# EAGLE design maplemini-r1 (EAGLE 5.01)
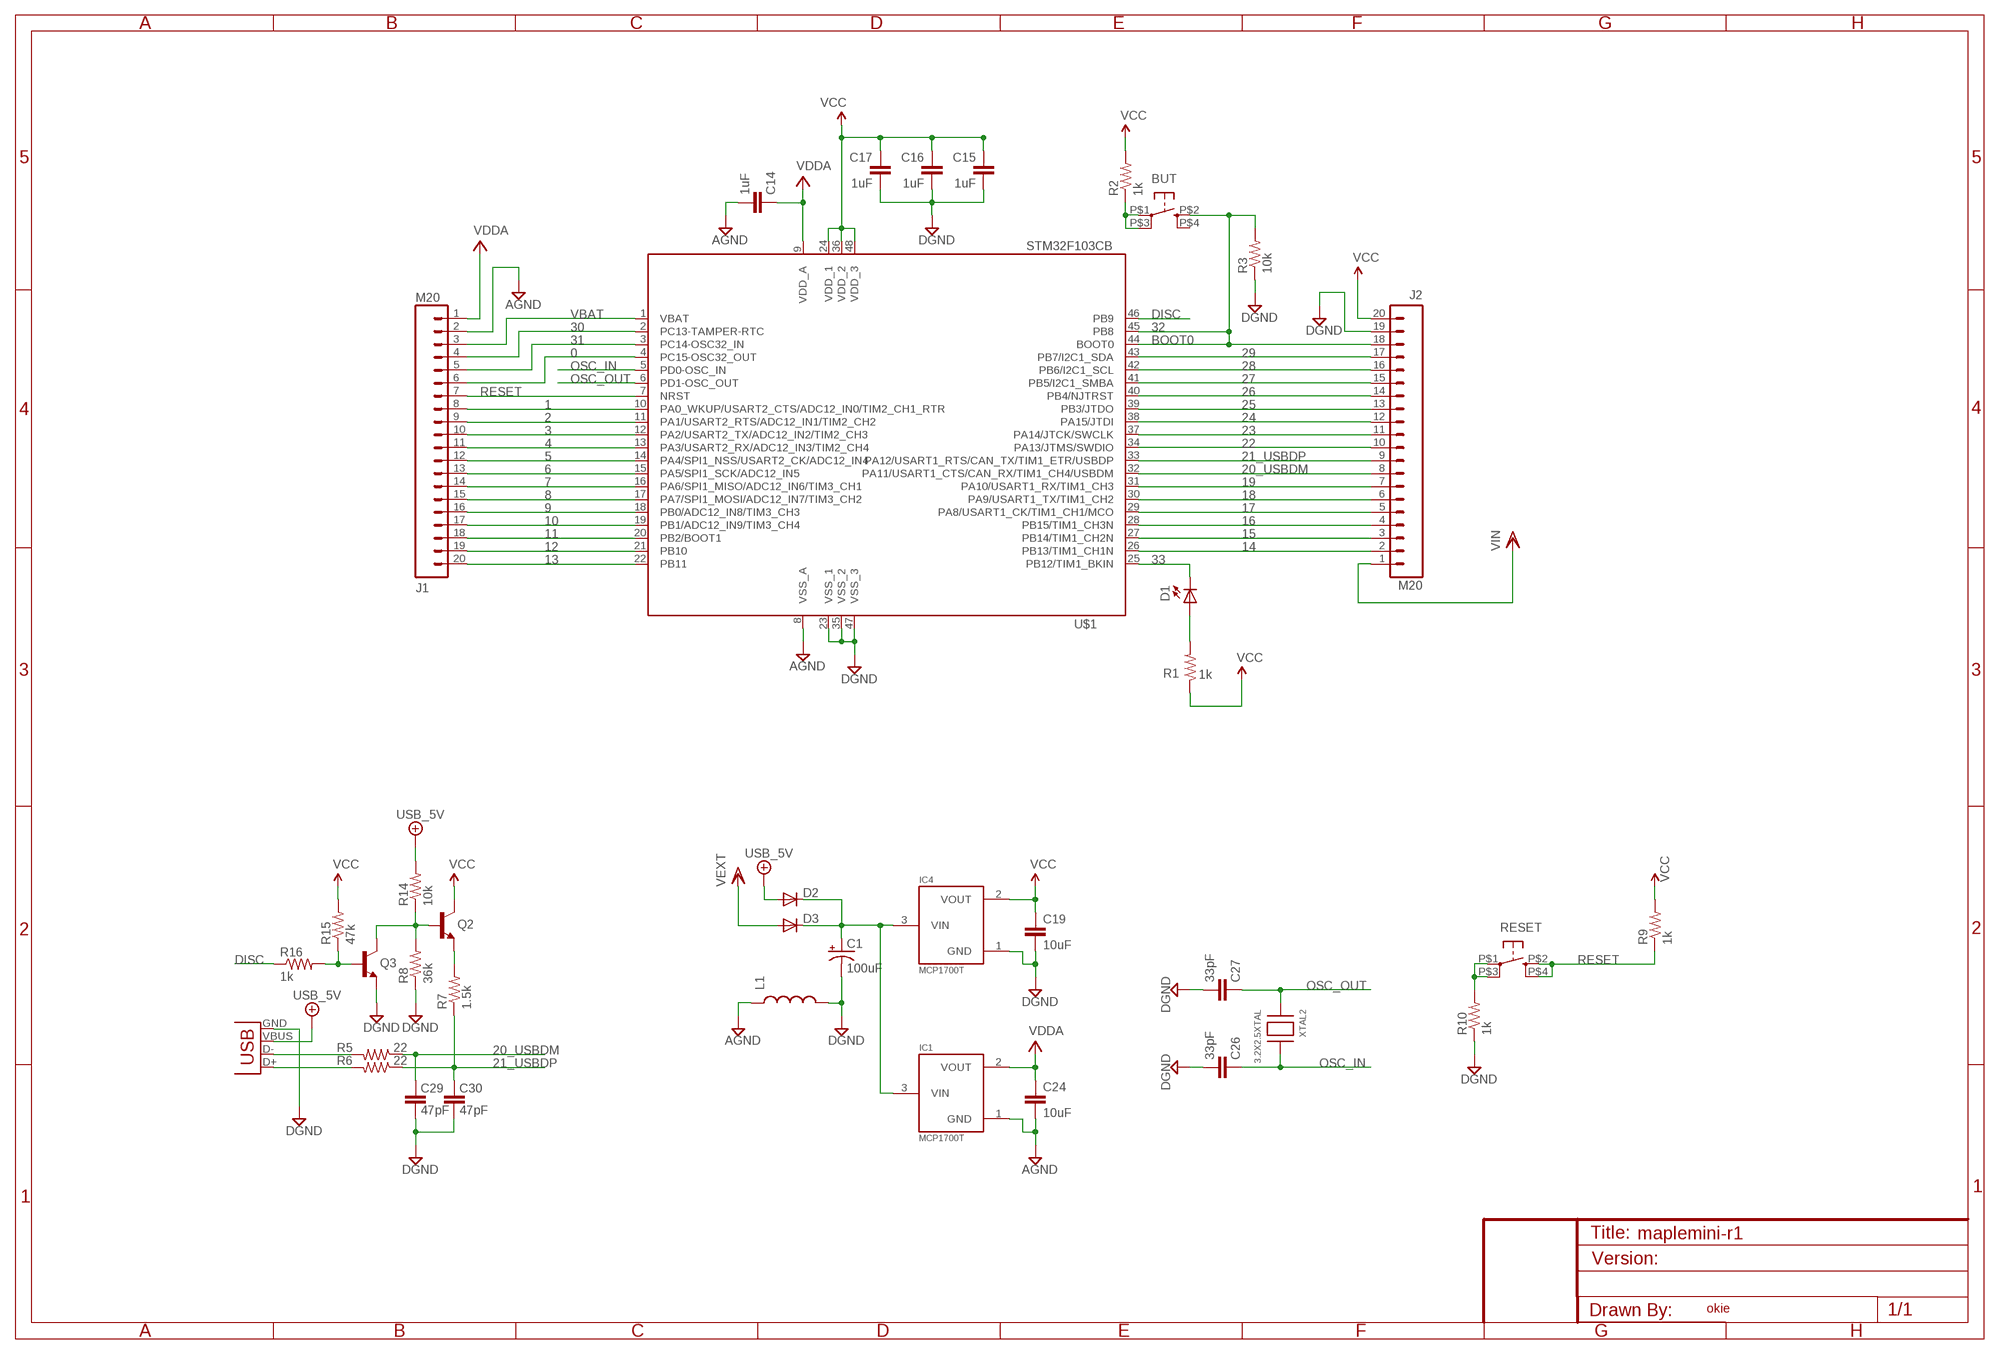
[diagram p0: schematic, sheet 1]

## Parts
BUT  BUTTON-KMR241GLFS  [PUSHBUTTON-KMR241GLFS]
C1  100uF  CAP_POL1206  [EIA3216]
C14  1uF  CAP0402  [C0402]
C15  1uF  CAP0402  [C0402]
C16  1uF  CAP0402  [C0402]
C17  1uF  CAP0402  [C0402]
C19  10uF  CAP0805  [0805]
C24  10uF  CAP0805  [0805]
C26  33pF  CAP0402  [C0402]
C27  33pF  CAP0402  [C0402]
C29  47pF  CAP0402  [C0402]
C30  47pF  CAP0402  [C0402]
D1  Green  LED0603  [LED-0603]
D2  DIODESOD  [SOD-323]
D3  DIODESOD  [SOD-323]
IC1  MCP1700T  [SOT23]
IC4  MCP1700T  [SOT23]
J1  M20  [1X20]
J2  M20  [1X20]
L1  INDUCTOR0603  [0603]
Q2  TRANSISTOR_NPNSOT23  [SOT23]
Q3  TRANSISTOR_NPNSOT23  [SOT23]
R1  1k  RESISTOR0402  [C0402]
R2  1k  RESISTOR0402  [C0402]
R3  10k  RESISTOR0402  [C0402]
R5  22  RESISTOR0402  [C0402]
R6  22  RESISTOR0402  [C0402]
R7  1.5k  RESISTOR0402  [C0402]
R8  36k  RESISTOR0402  [C0402]
R9  1k  RESISTOR0402  [C0402]
R10  1k  RESISTOR0402  [C0402]
R14  10k  RESISTOR0402  [C0402]
R15  47k  RESISTOR0402  [C0402]
R16  1k  RESISTOR0402  [C0402]
RESET  BUTTON-KMR241GLFS  [PUSHBUTTON-KMR241GLFS]
U$1  STM32F103CB  [LQFP48]
X2  USBSMD  [USB-MINIB]
XTAL2  3.2X2.5XTAL  [3.2X2.5XTAL]

## Nets
0: J1.6 U$1.4(PC15-OSC32_OUT)
1: J1.8 U$1.10(PA0_WKUP/USART2_CTS/ADC12_IN0/TIM2_CH1_RTR)
2: J1.9 U$1.11(PA1/USART2_RTS/ADC12_IN1/TIM2_CH2)
3: J1.10 U$1.12(PA2/USART2_TX/ADC12_IN2/TIM2_CH3)
4: J1.11 U$1.13(PA3/USART2_RX/ADC12_IN3/TIM2_CH4)
5: J1.12 U$1.14(PA4/SPI1_NSS/USART2_CK/ADC12_IN4)
6: J1.13 U$1.15(PA5/SPI1_SCK/ADC12_IN5)
7: J1.14 U$1.16(PA6/SPI1_MISO/ADC12_IN6/TIM3_CH1)
8: J1.15 U$1.17(PA7/SPI1_MOSI/ADC12_IN7/TIM3_CH2)
9: J1.16 U$1.18(PB0/ADC12_IN8/TIM3_CH3)
10: J1.17 U$1.19(PB1/ADC12_IN9/TIM3_CH4)
11: J1.18 U$1.20(PB2/BOOT1)
12: J1.19 U$1.21(PB10)
13: J1.20 U$1.22(PB11)
14: J2.2 U$1.26(PB13/TIM1_CH1N)
15: J2.3 U$1.27(PB14/TIM1_CH2N)
16: J2.4 U$1.28(PB15/TIM1_CH3N)
17: J2.5 U$1.29(PA8/USART1_CK/TIM1_CH1/MCO)
18: J2.6 U$1.30(PA9/USART1_TX/TIM1_CH2)
19: J2.7 U$1.31(PA10/USART1_RX/TIM1_CH3)
20_USBDM: C29.2 J2.8 R5.1 U$1.32(PA11/USART1_CTS/CAN_RX/TIM1_CH4/USBDM)
21_USBDP: C30.2 J2.9 R6.1 R7.1 U$1.33(PA12/USART1_RTS/CAN_TX/TIM1_ETR/USBDP)
22: J2.10 U$1.34(PA13/JTMS/SWDIO)
23: J2.11 U$1.37(PA14/JTCK/SWCLK)
24: J2.12 U$1.38(PA15/JTDI)
25: J2.13 U$1.39(PB3/JTDO)
26: J2.14 U$1.40(PB4/NJTRST)
27: J2.15 U$1.41(PB5/I2C1_SMBA)
28: J2.16 U$1.42(PB6/I2C1_SCL)
29: J2.17 U$1.43(PB7/I2C1_SDA)
30: J1.4 U$1.2(PC13-TAMPER-RTC)
31: J1.5 U$1.3(PC14-OSC32_IN)
33: D1.C U$1.25(PB12/TIM1_BKIN)
+5V/2: D2.2(A) R14.2 X2.VBUS ; supply symbol labelled USB_5V
AGND: C14.2 C24.2 IC1.1(GND) J1.2 L1.1 U$1.8(VSS_A)
BOOT0: BUT.P$2 J2.18 R3.2 U$1.44(BOOT0) U$1.45(PB8)
DGND: C1.C(-) C15.2 C16.2 C17.2 C19.2 C26.2 C27.2 C29.1 C30.1 IC4.1(GND) J2.19 L1.2 Q3.2(E) R3.1 R8.1 R10.1 U$1.23(VSS_1) U$1.35(VSS_2) U$1.47(VSS_3) X2.GND
DISC: R16.1 U$1.46(PB9)
N$1: BUT.P$1 BUT.P$3 R2.1
N$4: R10.2 RESET.P$1 RESET.P$3
N$5: C1.A(+) D2.1(C) D3.1(C) IC1.3(VIN) IC4.3(VIN)
N$51: Q2.2(E) R7.2
N$59: R5.2 X2.D-
N$60: R6.2 X2.D+
N$69: D1.A R1.2
N$71: Q2.1(B) Q3.3(C) R8.2 R14.1
N$73: Q3.1(B) R15.1 R16.2
OSC_IN: C26.1 U$1.5(PD0-OSC_IN) XTAL2.P$3
OSC_OUT: C27.1 U$1.6(PD1-OSC_OUT) XTAL2.P$1
RESET: J1.7 R9.1 RESET.P$2 RESET.P$4 U$1.7(NRST)
VBAT: J1.3 U$1.1(VBAT)
VCC: C15.1 C16.1 C17.1 C19.1 IC4.2(VOUT) J2.20 Q2.3(C) R1.1 R2.2 R9.2 R15.2 U$1.24(VDD_1) U$1.36(VDD_2) U$1.48(VDD_3)
VDDA: C14.1 C24.1 IC1.2(VOUT) J1.1 U$1.9(VDD_A)
VEXT: D3.2(A) J2.1 ; supply symbol labelled VIN
Unconnected: BUT.P$4

## Notes on the sheet
- 32
- okie

## Library data of the parts
BUT RESET = okie:BUTTON-KMR241GLFS
C1 = SparkFun3:CAP_POL: Capacitor Polarized These are standard SMD and PTH capacitors. Normally 10uF, 47uF, and 100uF in electrolytic and tantalum varieties. Always verify the external diameter of the through hole cap, it varies with capacity, voltage, and manufacturer. The EIA devices should be standard.
C14-C17 C26 C27 C29 C30 = SparkFun:CAP: Capacitor Standard 0603 ceramic capacitor, and 0.1" leaded capacitor.
C19 C24 = SparkFun2:CAP: Capacitor Standard 0603 ceramic capacitor, and 0.1" leaded capacitor.
D1 = SparkFun:LED: LEDs Standard schematic elements and footprints for 5mm, 3mm, 1206, and 0603 sized LEDs. 5mm - Spark Fun Electronics SKU : COM-00529 (and others)
D2 D3 = SparkFun3:DIODE: Diode These are standard reverse protection diodes and small signal diodes. SMA package can handle up to about 1A. SOD-323 can handle about 200mA. What the SOD-323 package when ordering, there are some mfgs out there that are 5-pin packages.
IC1 IC4 = okie:MCP1700T
J1 J2 = SparkFun3:M20: This is just like the LOCK variant in that the holes are staggared by 5 mil, but except for the last two holes. They are not altered from the "standard" footprint layout. This is used for a special purpose on the layout of our Graphic LCD Backpack. Make sure you want to use this device before selecting it for you project!
L1 = SparkFun3:INDUCTOR: Inductors Basic Inductor/Choke - 0603 and 1206. Footprints are not proven and vary greatly between part numbers.
Q2 Q3 = SparkFun2:TRANSISTOR_NPN: Transistor NPN BJT configuration in SOT23 package. MMBT2222 is the common NPN we use. Double check BCE configuration again layout.
R1-R3 R5-R10 R14-R16 = SparkFun:RESISTOR: Resistor Basic schematic elements and footprints for 0603, 1206, and PTH 1/10th watt (small) resistors.
U$1 = stm32:STM32F103CB
X2 = SparkFun2:USB: USB Connectors USB-B-PTH is fully proven SKU : PRT-00139 USB-miniB is fully proven SKU : PRT-00587 USB-A-PCB is untested. USB-A-H is throughly reviewed, but untested. Spark Fun Electronics SKU : PRT-00437 USB-B-SMT is throughly reviewed, but untested. Needs silkscreen touching up. USB-A-S has not been used/tested USB-MB-H has not been used/tested
XTAL2 = okie:3.2X2.5XTAL

## Net classes
1 vcc: width 0.254 mm

## Board
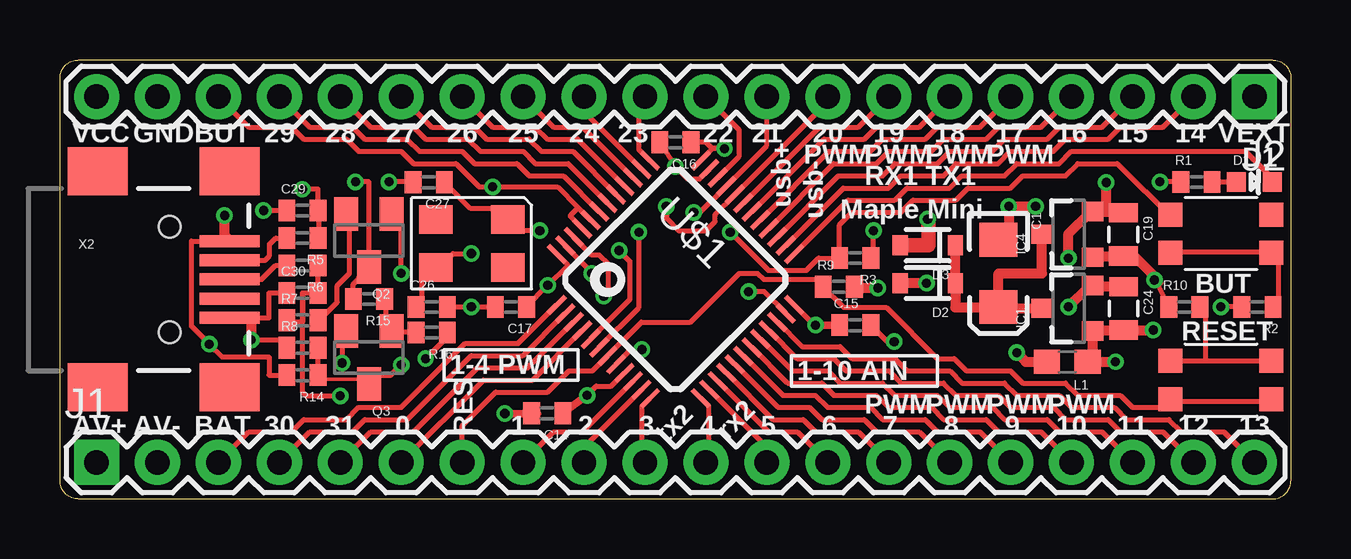
[diagram p1: board, top side]
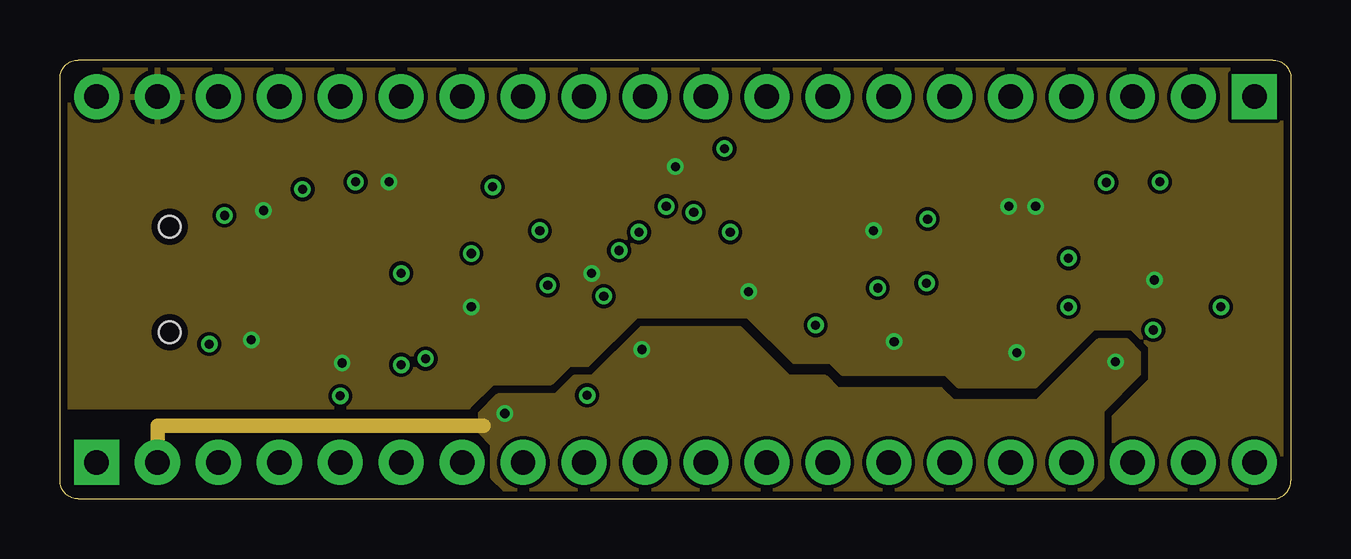
[diagram p2: board, inner layer GND]
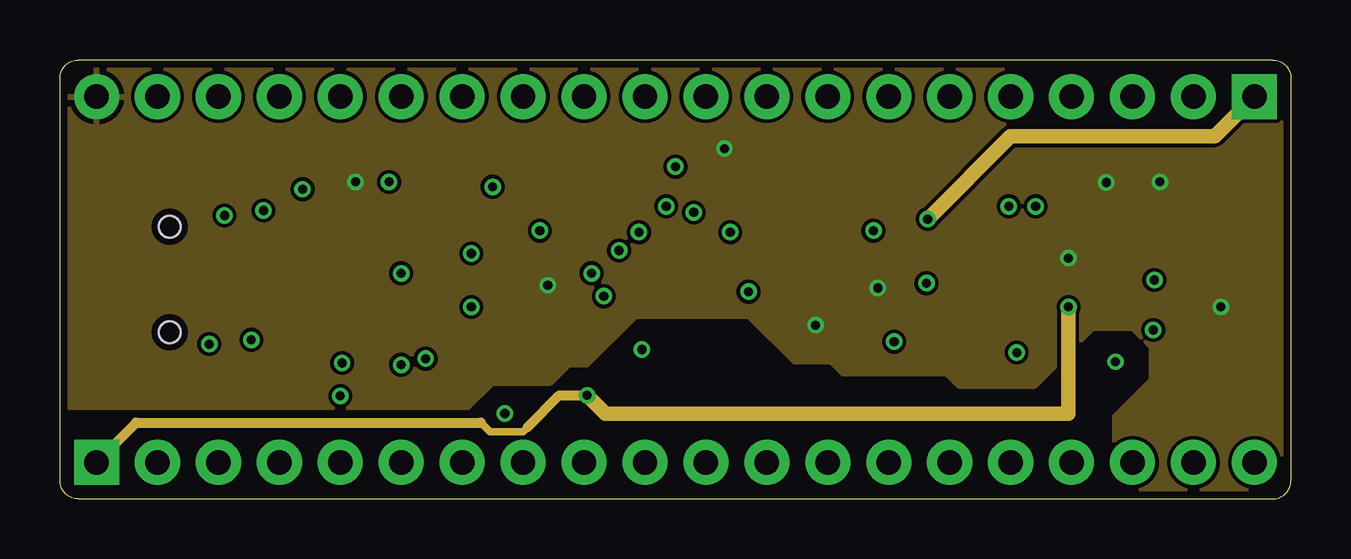
[diagram p3: board, inner layer SUPPLY]
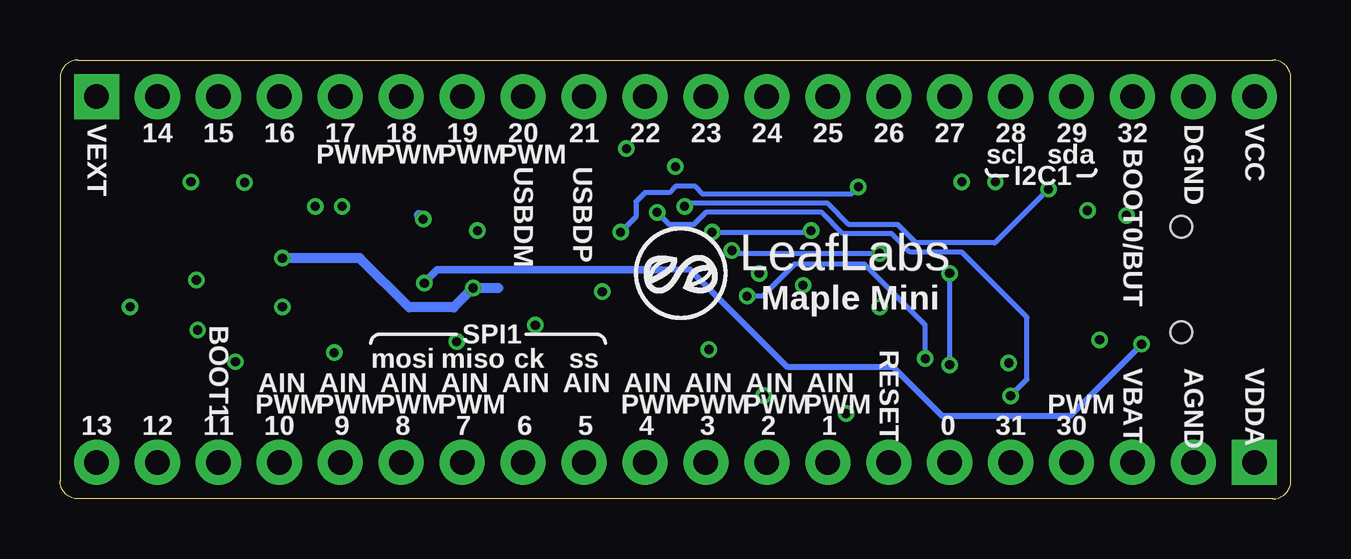
[diagram p4: board, bottom side, seen from below]

Size 51.31 x 18.29 mm. Coordinates in mm from the lower left corner, seen from the top.
Outline: 0.76,0 50.55,0 arc90 51.31,0.76 51.31,17.53 arc90 50.55,18.29 0.76,18.29 arc90 0,17.53 0,0.76 arc90 0.76,0
Copper layers (1*16): Top 0.035mm / dielectric 1.5mm / Bottom 0.035mm
Design rules "default *": minimum track width 6mil, minimum drill 15mil, track to track 6mil, track to pad 6mil, pad to pad 6mil, via to via 6mil, smd to smd 6mil, copper to edge 12mil, drill to drill 15mil, minimum pad ring 6mil, minimum via ring 6mil, stop-mask expansion 0mil, vias tented up to drill 15mil, thermal gap 8mil

### Footprints (pad centres in the part's own frame; a part is rotated, then mirrored left to right if it is on the bottom)
PUSHBUTTON-KMR241GLFS = smd 1 x 1: P$1 2.1,0.8; P$2 2.1,-0.8; P$3 -2.1,0.8; P$4 -2.1,-0.8
EIA3216 = smd 1.4 x 1.6: A 1.4,0; C -1.4,0
C0402 = smd 0.7 x 0.9: 1 -0.65,0; 2 0.65,0
0805 = smd 0.8 x 1.2: 1 -0.9,0; 2 0.9,0
LED-0603 = smd 0.8 x 0.8: A 0,-0.75; C 0,0.75
SOD-323 = smd 0.63 x 0.83: 1 -1.15,0; 2 1.15,0
SOT23 = smd 0.8 x 0.9: 1 -0.95,-1; 2 0.95,-1; 3 0,1.1
1X20 = drill 1.016 pad 1.88 square: 1 0,0 | drill 1.016 pad 1.88 round: 2 2.54,0; 3 5.08,0; 4 7.62,0; 5 10.16,0; 6 12.7,0; 7 15.24,0; 8 17.78,0; 9 20.32,0; 10 22.86,0; 11 25.4,0; 12 27.94,0; 13 30.48,0; 14 33.02,0; 15 35.56,0; 16 38.1,0; 17 40.64,0; 18 43.18,0; 19 45.72,0; 20 48.26,0
0603 = smd 1.1 x 1: 1 -0.85,0; 2 0.85,0
SOT23' = smd 1 x 1.4: 1 -0.95,-1.1; 2 0.95,-1.1; 3 0,1.1
LQFP48 = smd 0.2 x 1: 1 -2.75,-4.25; 2 -2.25,-4.25; 3 -1.75,-4.25; 4 -1.25,-4.25; 5 -0.75,-4.25; 6 -0.25,-4.25; 7 0.25,-4.25; 8 0.75,-4.25; 9 1.25,-4.25; 10 1.75,-4.25; 11 2.25,-4.25; 12 2.75,-4.25; 25 2.75,4.25; 26 2.25,4.25; 27 1.75,4.25; 28 1.25,4.25; 29 0.75,4.25; 30 0.25,4.25; 31 -0.25,4.25; 32 -0.75,4.25; 33 -1.25,4.25; 34 -1.75,4.25; 35 -2.25,4.25; 36 -2.75,4.25 | smd 1 x 0.2: 13 4.25,-2.75; 14 4.25,-2.25; 15 4.25,-1.75; 16 4.25,-1.25; 17 4.25,-0.75; 18 4.25,-0.25; 19 4.25,0.25; 20 4.25,0.75; 21 4.25,1.25; 22 4.25,1.75; 23 4.25,2.25; 24 4.25,2.75; 37 -4.25,2.75; 38 -4.25,2.25; 39 -4.25,1.75; 40 -4.25,1.25; 41 -4.25,0.75; 42 -4.25,0.25; 43 -4.25,-0.25; 44 -4.25,-0.75; 45 -4.25,-1.25; 46 -4.25,-1.75; 47 -4.25,-2.25; 48 -4.25,-2.75
USB-MINIB = smd 2.5 x 0.5: D+ 2.5,0; D- 2.5,0.8; GND 2.5,-1.6; ID 2.5,-0.8; VBUS 2.5,1.6 | smd 2.5 x 2: GND@1 -3,-4.5; GND@2 -3,4.5; GND@3 2.5,4.5; GND@4 2.5,-4.5 | hole 0.9: 0,2.2; 0,-2.2
3.2X2.5XTAL = smd 1.4 x 1.2: P$1 -1.5,-1; P$2 1.5,-1; P$3 1.5,1; P$4 -1.5,1

### Placement (x,y rotation side)
BUT  48.39,11.05 180 top
C1  39.12,9.4 270 top
C14  20.31,3.57 180 top
C15  33.15,7.24 0 top
C16  25.65,14.86 180 top
C17  18.8,8 180 top
C19  44.32,11.02 270 top
C24  44.34,7.94 270 top
C26  15.49,8 0 top
C27  15.37,13.2 180 top
C29  10.11,12.01 0 top
C30  10.11,8.59 0 top
D1  49.78,13.21 270 top
D2  36.17,8.99 180 top
D3  36.17,10.57 180 top
IC1  42.04,7.94 90 top
IC4  42.04,11.02 90 top
J1  1.52,1.52 0 top
J2  49.78,16.76 180 top
L1  41.99,5.71 180 top
Q2  [SOT23']  12.88,10.77 180 top
Q3  [SOT23']  12.88,5.89 180 top
R1  47.37,13.21 0 top
R2  49.91,8 180 top
R3  33.15,10.03 180 top
R5  10.11,10.87 180 top
R6  10.11,9.73 180 top
R7  10.11,7.44 0 top
R8  10.11,6.3 0 top
R9  32.46,8.84 0 top
R10  46.86,8 0 top
R14  10.11,5.16 180 top
R15  12.88,8.33 180 top
R16  15.49,6.93 180 top
RESET  48.39,4.95 0 top
U$1  25.65,9.14 315 top
X2  4.57,9.14 0 top
XTAL2  17.16,10.64 180 top

### Tracks (layer width: path | path; a pad name or v marks a point on that pad's centre or on a via)
0
  Top 0.203: J1.6 17.65,4.95 19.7,4.95 U$1.4
1
  Top 0.203: U$1.10 21.78,2.79 20.57,2.79 J1.8
2
  Top 0.203: U$1.11 21.84,2.15 J1.9
3
  Top 0.203: J1.10 24.26,1.65 24.26,3.86 U$1.12
4
  Top 0.203: J1.11 27.05,1.65 27.05,3.86 U$1.13
5
  Top 0.203: U$1.14 29.46,2.15 J1.12
6
  Top 0.203: J1.13 30.73,2.79 29.53,2.79 U$1.15
7
  Top 0.203: J1.14 33.27,2.79 31.5,2.79 30.99,3.3 29.73,3.3 U$1.16
8
  Top 0.203: J1.15 35.81,2.79 34.04,2.79 33.53,3.3 31.75,3.3 31.24,3.81 29.93,3.81 U$1.17
9
  Top 0.203: J1.16 38.35,2.79 36.58,2.79 36.07,3.3 34.29,3.3 33.78,3.81 32,3.81 31.5,4.32 30.13,4.32 U$1.18
10
  Top 0.203: J1.17 40.89,2.79 39.12,2.79 38.61,3.3 36.83,3.3 36.32,3.81 34.54,3.81 34.04,4.32 32.26,4.32 31.75,4.83 30.32,4.83 U$1.19
11
  Top 0.203: U$1.20 30.52,5.33 32,5.33 32.51,4.83 34.29,4.83 34.8,4.32 36.58,4.32 37.08,3.81 38.86,3.81 39.37,3.3 41.15,3.3 41.66,2.79 43.43,2.79 J1.18
12
  Top 0.203: U$1.21 30.72,5.84 32.26,5.84 32.77,5.33 34.54,5.33 35.05,4.83 36.83,4.83 37.34,4.32 39.12,4.32 39.62,3.81 41.4,3.81 41.91,3.3 43.69,3.3 44.2,2.79 45.97,2.79 J1.19
13
  Top 0.203: U$1.22 30.92,6.35 32.51,6.35 33.02,5.84 34.8,5.84 35.31,5.33 37.08,5.33 37.59,4.83 39.37,4.83 39.88,4.32 41.66,4.32 42.16,3.81 43.94,3.81 44.45,3.3 46.23,3.3 46.74,2.79 48.51,2.79 J1.20
14
  Top 0.203: U$1.26 32.65,12.95 34.54,12.95 35.05,13.46 36.83,13.46 37.34,13.97 39.12,13.97 39.62,14.48 41.4,14.48 41.91,14.99 43.69,14.99 44.2,15.49 45.97,15.49 J2.2
15
  Top 0.203: U$1.27 32.45,13.46 34.29,13.46 34.8,13.97 36.58,13.97 37.08,14.48 38.86,14.48 39.37,14.99 41.15,14.99 41.66,15.49 43.43,15.49 J2.3
16
  Top 0.203: U$1.28 32.25,13.97 34.04,13.97 34.54,14.48 36.32,14.48 36.83,14.99 38.61,14.99 39.12,15.49 40.89,15.49 J2.4
17
  Top 0.203: U$1.29 32.05,14.48 33.78,14.48 34.29,14.99 36.07,14.99 36.58,15.49 38.35,15.49 J2.5
18
  Top 0.203: U$1.30 31.85,14.99 33.53,14.99 34.04,15.49 35.81,15.49 J2.6
19
  Top 0.203: U$1.31 31.65,15.49 33.27,15.49 J2.7
20_USBDM  (via drill 0.38)
  Top 0.203: J2.8 32,16.55 U$1.32 27.3,11.86 27.3,11.81 27.3,11.56 26.92,11.18 25.78,11.18 25.27,11.68 v25.27,12.19 | 10.76,11.98 10.77,11.99 C29.2 10.76,12.03 | R5.1 10.79,10.91 10.79,11.99 10.76,12.03 | 10.76,12.03 10.76,12.9 v10.11,12.9
  Bottom 0.203: v25.27,12.19 25.27,12.32 19.3,12.32 18.41,11.43 16.38,11.43 15.62,10.67 12.34,10.67 v10.11,12.9
21_USBDP  (via drill 0.38)
  Top 0.203: J2.9 29.46,14.72 U$1.33 26.68,11.94 26.54,11.94 | 9.53,7.44 R7.1 9.54,7.44 9.61,7.37 10.11,7.37 10.11,8.59 | R6.1 10.76,9.67 10.74,9.65 10.76,9.64 10.76,8.73 10.67,8.64 10.72,8.59 C30.2 10.11,8.59 | 26.54,11.94 26.67,11.94 | 10.11,8.59 10.11,4.45 10.26,4.29 v11.68,4.29 | v26.42,11.94 26.54,11.94
  Bottom 0.203: v26.42,11.94 25.91,11.43 24.89,11.43 24.38,11.94 19.56,11.94 18.67,11.05 16.64,11.05 15.88,10.29 13.72,10.29 11,7.57 11,4.98 v11.68,4.29
22
  Top 0.203: J2.10 28.32,15.37 28.32,14.29 U$1.34
23
  Top 0.203: J2.11 24.26,16.64 24.13,16.64 24.13,14.56 U$1.37
24
  Top 0.203: U$1.38 21.84,16.14 J2.12
25
  Top 0.203: U$1.39 21.78,15.49 20.57,15.49 J2.13
26
  Top 0.203: U$1.40 21.58,14.99 20.32,14.99 19.81,15.49 18.03,15.49 J2.14
27
  Top 0.203: U$1.41 21.38,14.48 20.07,14.48 19.56,14.99 17.78,14.99 17.27,15.49 15.49,15.49 J2.15
28
  Top 0.203: U$1.42 21.18,13.97 19.81,13.97 19.3,14.48 17.53,14.48 17.02,14.99 15.24,14.99 14.73,15.49 12.95,15.49 J2.16
29
  Top 0.203: U$1.43 20.98,13.46 19.56,13.46 19.05,13.97 17.27,13.97 16.76,14.48 14.99,14.48 14.48,14.99 12.7,14.99 12.19,15.49 10.41,15.49 J2.17
30
  Top 0.203: U$1.2 19.3,5.97 17.14,5.97 14.48,3.3 12.7,3.3 12.19,2.79 10.41,2.79 J1.4
31
  Top 0.203: U$1.3 19.5,5.46 17.4,5.46 14.73,2.79 12.95,2.79 J1.5
33
  Top 0.203: U$1.25 32.84,12.45 34.8,12.45 35.31,12.95 37.08,12.95 37.59,13.46 39.37,13.46 39.88,13.97 41.66,13.97 42.16,14.48 49.4,14.48 50.67,13.21 D1.C 50.66,13.47
+5V/2  (via drill 0.38)
  Top 0.203: R14.2 8.71,5.16 8.71,5.92 6.76,5.92 v6.22,6.45 | X2.VBUS 5.49,10.74 5.49,7.19 6.2,6.48
  Top 0.254: v6.22,6.45 6.2,6.48
  Top 0.406: X2.VBUS 6.86,10.96 v6.86,11.81 | v36.12,8.99 D2.2
  Bottom 0.254: 26.26,9.55 25.04,9.55 20.98,5.49 16.56,5.49 14.53,3.45 9.22,3.45 v6.22,6.45
  Bottom 0.305: v36.12,8.99 36.12,9 36.13,9.02 35.6,9.55 26.26,9.55
AGND  (via drill 0.38)
  Top 0.203: U$1.8 23.75,6.18 v24.26,6.22
  Top 0.305: C14.2 19.91,3.56 v18.54,3.56
  Top 0.406: C24.2 v45.57,7.04 | v43.99,5.71 L1.1 42.96,5.84 43.05,5.84 43.05,6.98 IC1.1 43.04,7.04 C24.2 | C24.2
  GND 0.61: 17.65,3.05 4.06,3.05 J1.2
  pour GND: 43.31,6.6 44.45,6.6 44.96,6.1 44.96,5.21 43.43,3.68 43.43,0.89 42.93,0.38 18.54,0.38 18.03,0.89 18.03,2.29 17.53,2.79 17.53,3.56 18.29,4.32 20.7,4.32 21.46,5.08 22.23,5.08 24.26,7.11 28.32,7.11 30.35,5.08 31.88,5.08 32.38,4.57 36.7,4.57 37.21,4.06 40.77,4.06
BOOT0  (via drill 0.38)
  Top 0.203: 21.6,12.14 U$1.44 | J2.18 7.87,15.49 9.65,15.49 10.16,14.99 11.94,14.99 12.45,14.48 14.22,14.48 14.73,13.97 16.51,13.97 17.48,13.01 v18.03,13.01 | 21.27,11.81 | 21.6,12.14 21.27,11.81 | U$1.45 21.27,11.76 21.27,11.81 | v27.94,11.11 29.53,9.53 31.11,9.53 31.62,10.03 R3.2 32.5,11.41 33.02,11.94 35.05,11.94 35.56,12.45 37.34,12.45 37.85,12.95 39.62,12.95 40.13,13.46 41.91,13.46 42.42,13.97 44.07,13.97 46.35,11.68 46.27,11.72 BUT.P$2 | v18.03,13.01 18.01,13.01 18.06,12.95 | 21.6,12.14 20.73,13.01 v18.03,13.01
  Bottom 0.203: v18.03,13.01 18.34,12.7 24.51,12.7 24.83,13.02 25.65,13.02 25.91,12.76 26.92,12.76 27.3,12.38 27.3,11.75 v27.94,11.11
DGND  (via drill 0.38)
  Top 0.203: v17.14,8 17.18,8.04 | C26.2 v17.14,8 | v17.14,8 C17.2 | C27.2 14.7,13.21 v13.72,13.21 | C29.1 v8.48,12.01 | C30.1 8.71,8.59 8.71,7.54 X2.GND | X2.GND | U$1.47 22.16,9.45 v22.16,9.4 | C16.2 v25.65,13.84 26.16,13.34 26.66,13.34 U$1.35 | R3.1 33.91,9.89 v33.91,11.18 | U$1.23 29.34,8.64 v28.7,8.64 | C15.2 34.48,6.55 v34.77,6.55 | 45.9,8.99 v45.62,9.12 45.72,9.02 R10.1 | Q3.2 11.76,6.83 v11.76,5.66 | R8.1 9.22,6.54 9.22,6.63 v7.98,6.63
  Top 0.406: X2.GND 7.98,7.54 v7.98,6.63 | IC4.1 43.07,10.11 44.31,10.11 C19.2 44.77,10.12 45.74,9.14 v45.62,9.12 | L1.2 40.26,5.71 v39.88,6.1 | C1.C 39.57,11.26 39.57,12.17 v39.55,12.19 40.69,12.19
  other vias: 40.67,12.19
  pour GND: 0.38,17.91 50.93,17.91 50.93,0.38 44.45,0.38 43.94,0.89 43.94,3.43 45.47,4.95 45.47,6.35 44.7,7.11 43.05,7.11 40.64,4.7 37.47,4.7 36.96,5.21 32.64,5.21 32.13,5.71 30.61,5.71 28.7,7.62 24,7.62 21.97,5.59 21.21,5.59 20.45,4.83 18.03,4.83 17.02,3.81 0.38,3.81
DISC  (via drill 0.38)
  Top 0.203: U$1.46 22.16,10.16 22.48,10.16 22.86,9.78 22.86,8.64 v22.67,8.45 | R16.1 16.14,6.75 v15.24,5.84
  Bottom 0.203: v22.67,8.45 22.04,8.45 20.7,9.78 17.78,9.78 15.24,7.24 v15.24,5.84
N$1
  Top 0.203: R2.1 50.8,8.02 50.8,10.16 50.58,10.16 BUT.P$3 50.49,10.1 50.42,10.03 50.16,10.29 46.25,10.29 | 46.25,10.29 46.23,10.29 | 46.25,10.29 BUT.P$1
N$4
  Top 0.203: RESET.P$3 46.3,5.74 46.32,5.75 47.75,5.75 | 47.75,5.75 RESET.P$1 | R10.2 47.75,7.99 47.75,5.75
N$5
  Top 0.406: D3.1 37.29,10.54 37.32,10.51 D2.1 37.32,7.98 39.12,7.98 C1.A | IC1.3 39.12,7.95 C1.A | IC4.3 40.94,9.4 39.12,9.4 39.12,8.03 | C1.A 39.12,8.03 | 39.12,8.03 39.06,8.03
N$51
  Top 0.203: R7.2 10.79,7.44 11.56,8.2 11.56,8.89 12.06,9.4 12.06,11.43 11.93,11.57 Q2.2 11.64,11.58 11.63,11.58
N$59
  Top 0.203: R5.2 9.47,10.87 | R5.2 9.66,10.87 | X2.D- 8.55,9.94 8.74,10.13 8.74,10.62 8.99,10.87 R5.2
N$60
  Top 0.203: R6.2 8.99,9.73 8.41,9.14 X2.D+
N$69
  Top 0.203: 48.01,13.46 R1.2 D1.A
N$71  (via drill 0.38)
  Top 0.152: 10.75,5.14 10.91,4.98 12.69,4.98 Q3.3
  Top 0.203: 10.76,6.22 R8.2 R14.1 10.75,5.14 10.73,5.14 | 12.53,5.14 Q3.3 12.76,4.91 12.76,5.14 13.78,5.14 v14.22,5.59 | Q2.1 14.22,11.47 v14.22,9.4
  Bottom 0.203: v14.22,5.59 v14.22,9.4
N$73
  Top 0.203: R15.1 13.55,8.36 13.59,8.36 13.59,7.23 Q3.1 13.89,6.93 R16.2
OSC_IN  (via drill 0.38)
  Top 0.203: 15.09,8 15.09,7.82 | C26.1 15.09,8 | 15.09,8 15.09,9.64 XTAL2.P$3 15.8,9.64 16.38,10.22 v17.14,10.22 | U$1.5 23.75,8.3 23.75,9.91 v23.3,10.35
  Bottom 0.203: v23.3,10.35 23.18,10.22 v17.14,10.22
OSC_OUT  (via drill 0.38)
  Top 0.203: C27.1 | C27.1 16.1,13.11 16.1,13.08 16.13,13.08 17.12,12.09 18.12,12.09 18.17,12.14 XTAL2.P$1 18.66,11.5 18.8,11.18 v20,11.18 | C27.1 16.03,13.18 | U$1.6 24.13,7.97 v24.13,11.11
  Bottom 0.203: v20,11.18 19.94,11.18 20,11.11 v24.13,11.11
RESET
  Top 0.203: J1.7 16.76,3.05 18.16,4.45 20.32,4.45 21.21,5.33 22.2,5.33 U$1.7 24.23,7.37 26.29,7.37 28.32,9.4 29.08,9.4 29.34,9.14 31.83,9.14 31.8,9.12 R9.1 32.67,7.98 34.44,7.98 36.58,5.84 37.27,5.84 37.78,5.33 39.62,5.33 40.13,4.83 41.91,4.83 42.42,4.32 44.2,4.32 44.7,3.81 46.1,3.81 46.35,4.06 | 46.35,4.06 46.29,4.13 RESET.P$4 | RESET.P$2 50.39,4.06 46.35,4.06
VBAT
  Top 0.203: U$1.1 19.1,6.48 16.89,6.48 14.22,3.81 12.45,3.81 11.94,3.3 10.16,3.3 9.65,2.79 7.87,2.79 J1.3
VCC  (via drill 0.38)
  Top 0.203: 26.37,14.92 C16.1 26.92,14.86 27.18,14.61 27.69,14.61 | U$1.48 21.17,9.74 v20.33,8.9 19.45,8.02 C17.1 19.47,8.04 | R15.2 12.23,8.95 12.47,9.2 12.47,9.27 Q2.3 12.88,13.21 v12.32,13.21 | U$1.24 31.45,7.24 v31.5,7.24 | R2.2 v48.39,8 | R1.1 v45.85,13.21 | U$1.36 27.23,14.61 27.69,14.61 | 27.69,14.61 v27.7,14.59
  Top 0.305: 32.51,7.24 C15.1 v31.5,7.24
  Top 0.406: C19.1 44.32,11.96 IC4.2 | IC4.2 42.96,11.97 42.04,11.05 v42.04,10.03 | IC4.2 43.61,11.96 v43.61,13.18 | R9.2 33.16,8.79 v34.09,8.79
  Bottom 0.203: v20.33,8.9 20.32,8.91
  Bottom 0.406: v42.04,10.03 38.81,10.03 36.75,7.98 34.9,7.98 v34.09,8.79 33.05,8.79 | 20.32,8.91 v20.32,8.9 | v20.33,8.9 v20.32,8.9 | v20.32,8.9 v20.32,8.89 | v43.61,13.18 43.64,13.18 43.64,13.16 v43.61,13.18
  pour SUPPLY: 50.93,17.91 0.38,17.91 0.38,3.81 17.02,3.81 18.03,4.83 20.45,4.83 21.21,5.59 21.97,5.59 24,7.62 28.7,7.62 30.61,5.71 32.13,5.71 32.64,5.21 36.96,5.21 37.47,4.7 40.64,4.7 43.05,7.11 44.7,7.11 45.47,6.35 45.47,4.95 43.94,3.43 43.94,0.89 44.45,0.38 50.93,0.38
VDDA  (via drill 0.38)
  Top 0.203: U$1.9 22.98,4.7 22.35,4.7 v21.97,4.32
  Top 0.305: v21.97,4.32 C14.1
  Top 0.406: C24.1 44.34,8.87 43.04,8.87 | 43.04,8.87 IC1.2 | 43.04,8.87 42.9,8.87 v42.04,8
  SUPPLY 0.305: 19.51,3 19.3,2.79 17.93,2.79 17.55,3.17
  SUPPLY 0.406: J1.1 3.17,3.17 17.55,3.17 | v21.97,4.32 20.8,4.32 19.51,3
  SUPPLY 0.61: v42.04,8 42.04,3.56 22.73,3.56 v21.97,4.32
VEXT  (via drill 0.38)
  Top 0.61: 36.2,11.66 36.2,11.68 | 36.2,11.66 v36.17,11.66 | D3.2 36.2,10.57 36.2,11.66
  SUPPLY 0.61: J2.1 48.13,15.11 39.62,15.11 v36.17,11.66
  Bottom 0.406: v36.17,11.66 36.35,11.84

### Text on the board
_tsilk: VCC | GND | BUT | 29 | 28 | 27 | 26 | 25 | 24 | 23 | 22 | 21 | usb+ | 20 | 19 | 18 | 17 | 16 | 15 | 14 | VEXT | PWM | usb- | PWM | PWM | PWM | D1 | RX1 | TX1 | Maple Mini | BUT | RESET | 1-4 PWM | 1-10 AIN | PWM | PWM | PWM | PWM | AV+ | AV- | BAT | 30 | 31 | 0 | RES | 1 | 2 | 3 | 4 | 5 | 6 | 7 | 8 | 9 | 10 | 11 | 12 | 13 | tx2 | rx2
_bsilk: VCC | DGND | VEXT | BOOT0/BUT | 32 | 29 | 28 | 27 | 26 | 25 | 24 | 23 | 22 | 21 | 20 | 19 | 18 | 17 | 16 | 15 | 14 | sda | scl | USBDP | USBDM | PWM | PWM | PWM | PWM | I2C1 | LeafLabs | Maple Mini | BOOT1 | RESET | SPI1 | VDDA | AGND | VBAT | ss | ck | miso | mosi | PWM | AIN | PWM | AIN | PWM | AIN | PWM | AIN | PWM | AIN | AIN | AIN | PWM | AIN | PWM | AIN | PWM | AIN | PWM | 30 | 31 | 0 | 1 | 2 | 3 | 4 | 5 | 6 | 7 | 8 | 9 | 10 | 11 | 12 | 13